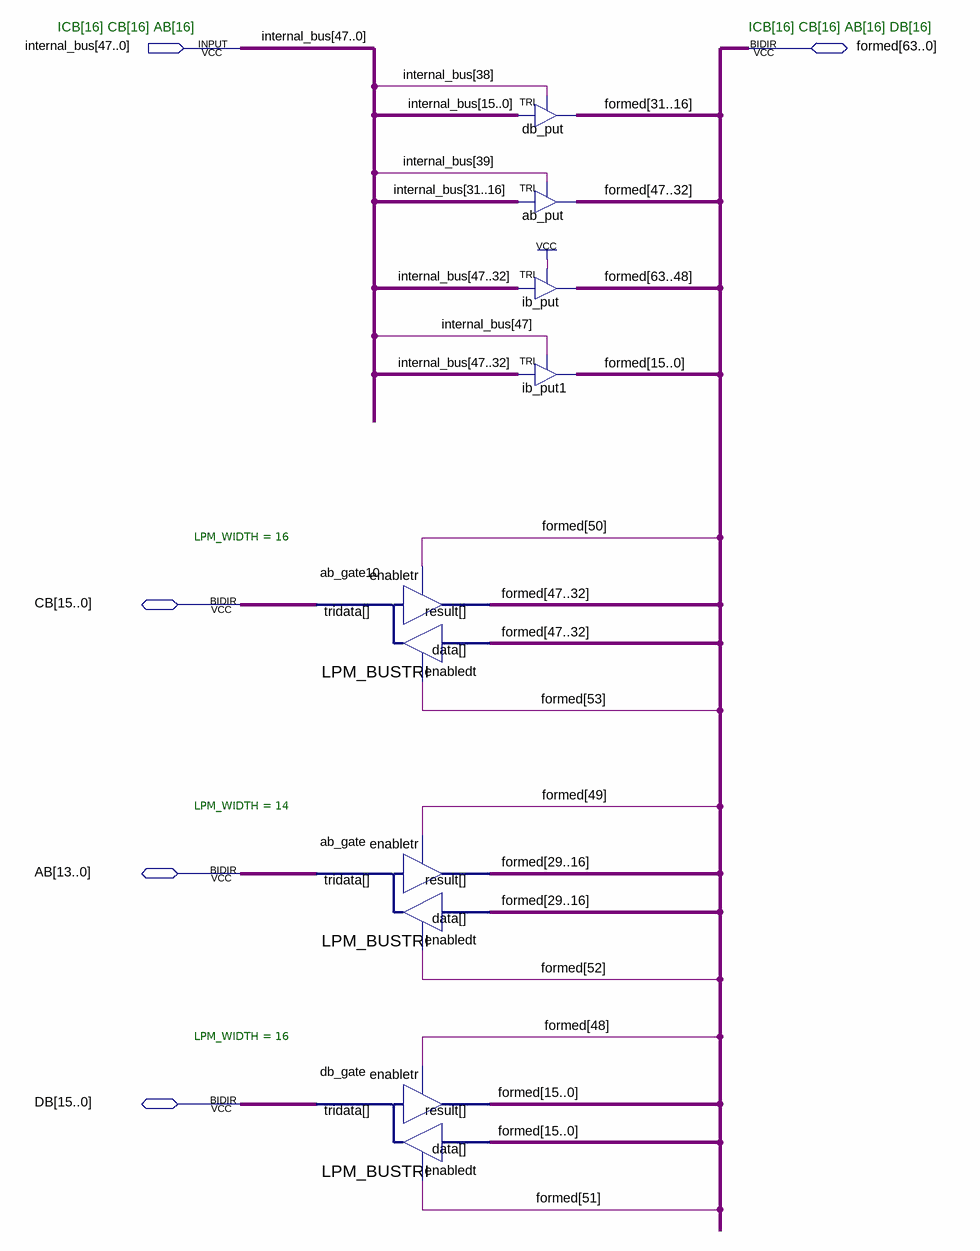
[diagram p0: schematic sheet]
// Quartus schematic internal_bus.bdf as structural Verilog: 7 symbols, 5 pins
module internal_bus (
  input  [47:0] internal_bus,
  inout  [63:0] formed,
  inout  [15:0] CB,
  inout  [13:0] AB,
  inout  [15:0] DB
);

  LPM_BUSTRI #(.LPM_WIDTH(16)) ab_gate10 (
    .data(formed[47:32]), .enabledt(formed[53]), .enabletr(formed[50]), .result(formed[47:32]), .tridata(CB));
  LPM_BUSTRI #(.LPM_WIDTH(14)) ab_gate (
    .data(formed[29:16]), .enabledt(formed[52]), .enabletr(formed[49]), .result(formed[29:16]), .tridata(AB));
  LPM_BUSTRI #(.LPM_WIDTH(16)) db_gate (
    .data(formed[15:0]), .enabledt(formed[51]), .enabletr(formed[48]), .result(formed[15:0]), .tridata(DB));
  TRI db_put[15:0] (.IN(internal_bus[15:0]), .OE(internal_bus[38]), .OUT(formed[31:16]));
  TRI ab_put[15:0] (.IN(internal_bus[31:16]), .OE(internal_bus[39]), .OUT(formed[47:32]));
  TRI ib_put[15:0] (.IN(internal_bus[47:32]), .OE(1'b1), .OUT(formed[63:48]));
  TRI ib_put1[15:0] (.IN(internal_bus[47:32]), .OE(internal_bus[47]), .OUT(formed[15:0]));

  // Notes on the sheet:
  //   ICB[16] CB[16] AB[16]
  //   ICB[16] CB[16] AB[16] DB[16]
endmodule
